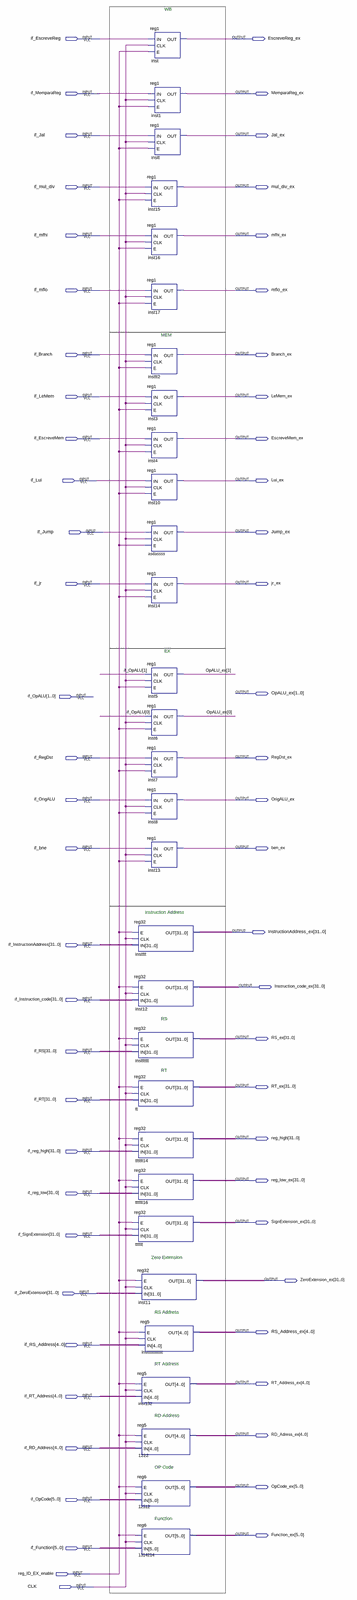
[diagram p0: schematic sheet, whole]
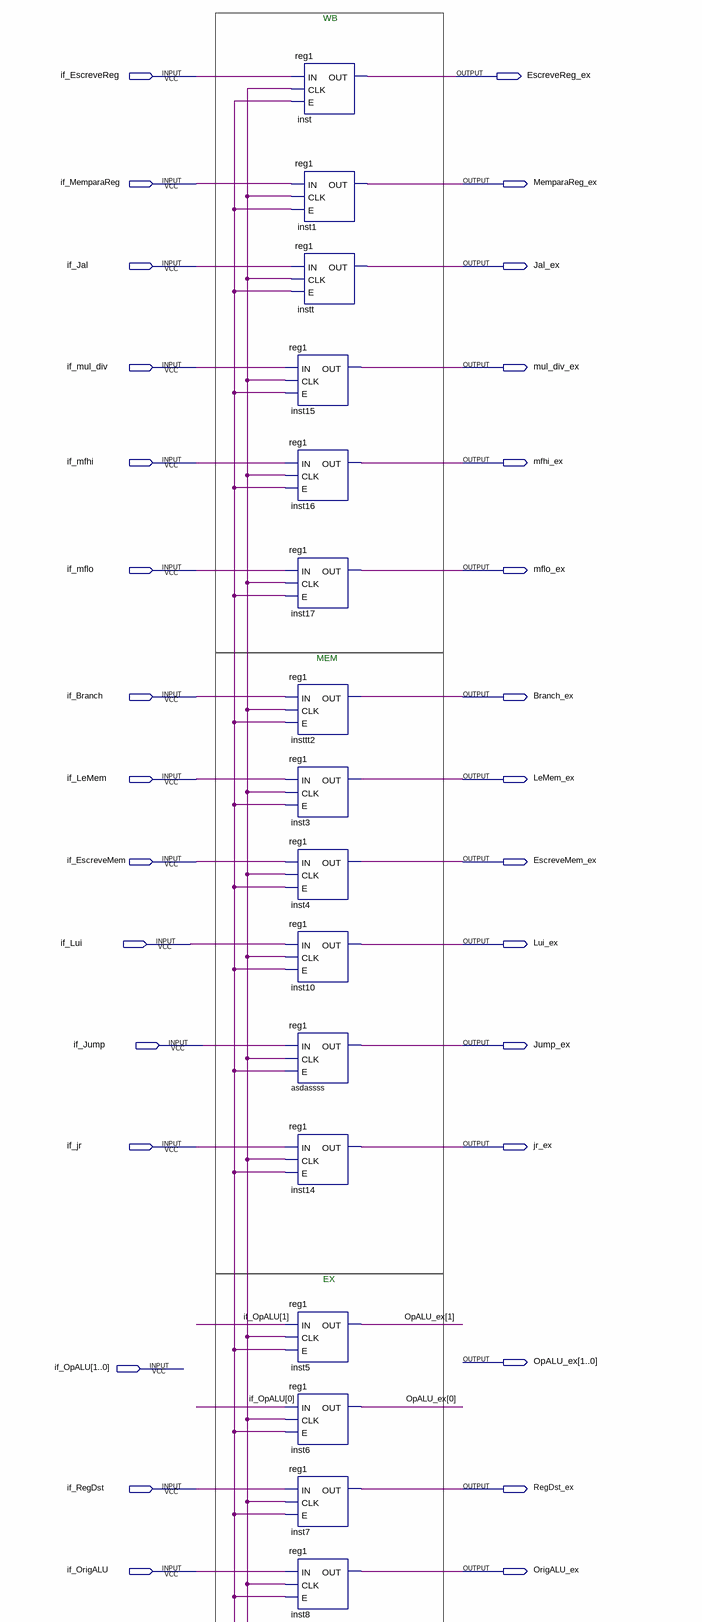
[diagram p1: schematic sheet, upper part]
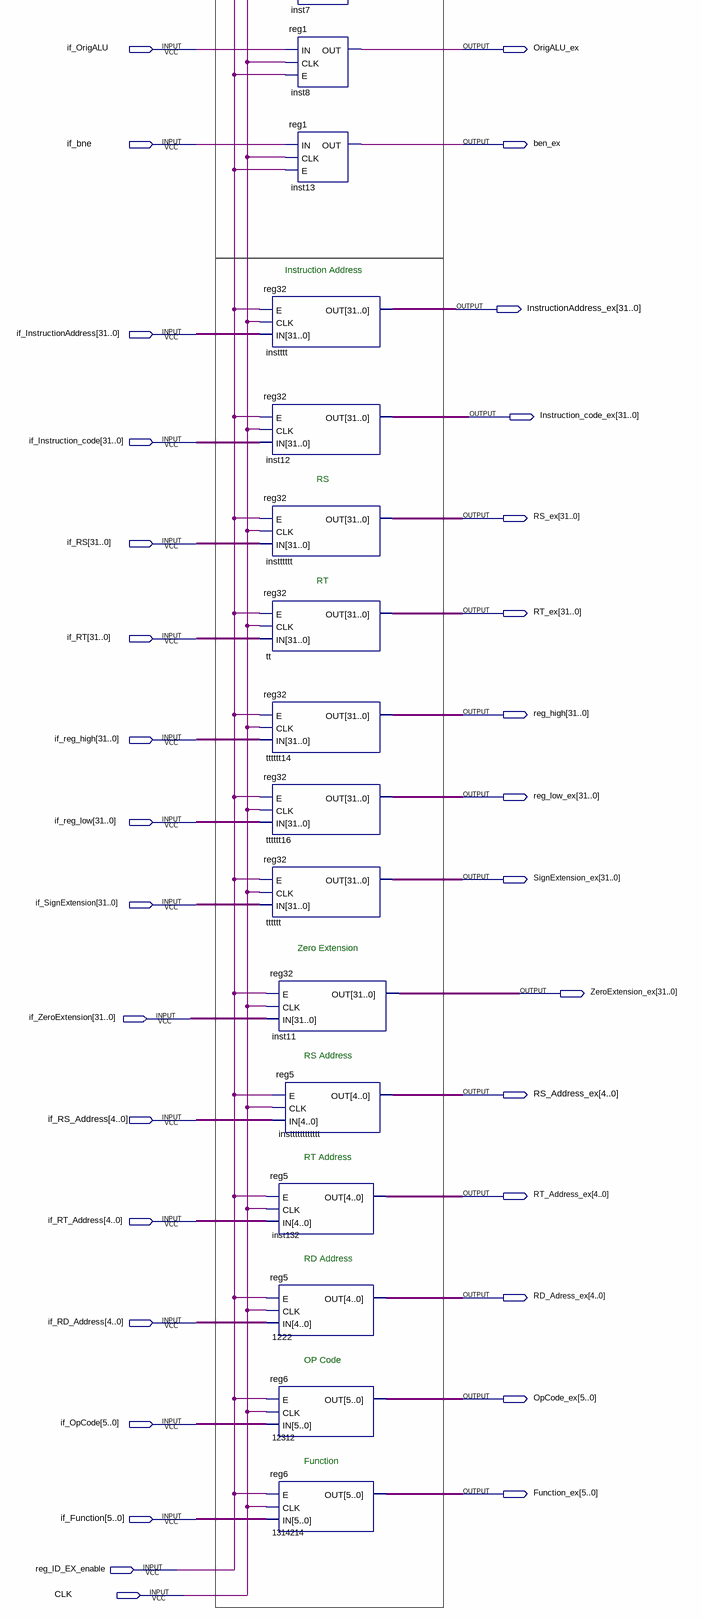
[diagram p2: schematic sheet, lower part]
// Quartus schematic reg_id_ex.bdf as structural Verilog: 30 symbols, 60 pins
module reg_id_ex (
  input  if_EscreveReg,
  input  if_MemparaReg,
  input  if_Jal,
  input  if_mul_div,
  input  if_mfhi,
  input  if_mflo,
  input  if_Branch,
  input  if_LeMem,
  input  if_EscreveMem,
  input  if_Lui,
  input  if_Jump,
  input  if_jr,
  input  [1:0] if_OpALU,
  input  if_RegDst,
  input  if_OrigALU,
  input  if_bne,
  input  [31:0] if_InstructionAddress,
  input  [31:0] if_Instruction_code,
  input  [31:0] if_RS,
  input  [31:0] if_RT,
  input  [31:0] if_reg_high,
  input  [31:0] if_reg_low,
  input  [31:0] if_SignExtension,
  input  [31:0] if_ZeroExtension,
  input  [4:0] if_RS_Address,
  input  [4:0] if_RT_Address,
  input  [4:0] if_RD_Address,
  input  [5:0] if_OpCode,
  input  [5:0] if_Function,
  input  reg_ID_EX_enable,
  input  CLK,
  output EscreveReg_ex,
  output MemparaReg_ex,
  output Jal_ex,
  output mul_div_ex,
  output mfhi_ex,
  output mflo_ex,
  output Branch_ex,
  output LeMem_ex,
  output EscreveMem_ex,
  output Lui_ex,
  output Jump_ex,
  output jr_ex,
  output [1:0] OpALU_ex,
  output RegDst_ex,
  output OrigALU_ex,
  output ben_ex,
  output [31:0] InstructionAddress_ex,
  output [31:0] Instruction_code_ex,
  output [31:0] RS_ex,
  output [31:0] RT_ex,
  output [31:0] reg_high,
  output [31:0] reg_low_ex,
  output [31:0] SignExtension_ex,
  output [31:0] ZeroExtension_ex,
  output [4:0] RS_Address_ex,
  output [4:0] RT_Address_ex,
  output [4:0] RD_Adress_ex,
  output [5:0] OpCode_ex,
  output [5:0] Function_ex
);

  reg1 inst (.IN(if_EscreveReg), .CLK(CLK), .E(reg_ID_EX_enable), .OUT(EscreveReg_ex));
  reg1 inst1 (.IN(if_MemparaReg), .CLK(CLK), .E(reg_ID_EX_enable), .OUT(MemparaReg_ex));
  reg1 instt (.IN(if_Jal), .CLK(CLK), .E(reg_ID_EX_enable), .OUT(Jal_ex));
  reg1 inst15 (.IN(if_mul_div), .CLK(CLK), .E(reg_ID_EX_enable), .OUT(mul_div_ex));
  reg1 inst16 (.IN(if_mfhi), .CLK(CLK), .E(reg_ID_EX_enable), .OUT(mfhi_ex));
  reg1 inst17 (.IN(if_mflo), .CLK(CLK), .E(reg_ID_EX_enable), .OUT(mflo_ex));
  reg1 insttt2 (.IN(if_Branch), .CLK(CLK), .E(reg_ID_EX_enable), .OUT(Branch_ex));
  reg1 inst3 (.IN(if_LeMem), .CLK(CLK), .E(reg_ID_EX_enable), .OUT(LeMem_ex));
  reg1 inst4 (.IN(if_EscreveMem), .CLK(CLK), .E(reg_ID_EX_enable), .OUT(EscreveMem_ex));
  reg1 inst10 (.IN(if_Lui), .CLK(CLK), .E(reg_ID_EX_enable), .OUT(Lui_ex));
  reg1 asdassss (.IN(if_Jump), .CLK(CLK), .E(reg_ID_EX_enable), .OUT(Jump_ex));
  reg1 inst14 (.IN(if_jr), .CLK(CLK), .E(reg_ID_EX_enable), .OUT(jr_ex));
  reg1 inst5 (.IN(if_OpALU[1]), .CLK(CLK), .E(reg_ID_EX_enable), .OUT(OpALU_ex[1]));
  reg1 inst6 (.IN(if_OpALU[0]), .CLK(CLK), .E(reg_ID_EX_enable), .OUT(OpALU_ex[0]));
  reg1 inst7 (.IN(if_RegDst), .CLK(CLK), .E(reg_ID_EX_enable), .OUT(RegDst_ex));
  reg1 inst8 (.IN(if_OrigALU), .CLK(CLK), .E(reg_ID_EX_enable), .OUT(OrigALU_ex));
  reg1 inst13 (.IN(if_bne), .CLK(CLK), .E(reg_ID_EX_enable), .OUT(ben_ex));
  reg32 instttt (.E(reg_ID_EX_enable), .CLK(CLK), .IN(if_InstructionAddress), .OUT(InstructionAddress_ex));
  reg32 inst12 (.E(reg_ID_EX_enable), .CLK(CLK), .IN(if_Instruction_code), .OUT(Instruction_code_ex));
  reg32 instttttt (.E(reg_ID_EX_enable), .CLK(CLK), .IN(if_RS), .OUT(RS_ex));
  reg32 tt (.E(reg_ID_EX_enable), .CLK(CLK), .IN(if_RT), .OUT(RT_ex));
  reg32 tttttt14 (.E(reg_ID_EX_enable), .CLK(CLK), .IN(if_reg_high), .OUT(reg_high));
  reg32 tttttt16 (.E(reg_ID_EX_enable), .CLK(CLK), .IN(if_reg_low), .OUT(reg_low_ex));
  reg32 tttttt (.E(reg_ID_EX_enable), .CLK(CLK), .IN(if_SignExtension), .OUT(SignExtension_ex));
  reg32 inst11 (.E(reg_ID_EX_enable), .CLK(CLK), .IN(if_ZeroExtension), .OUT(ZeroExtension_ex));
  reg5 instttttttttttt (.E(reg_ID_EX_enable), .CLK(CLK), .IN(if_RS_Address), .OUT(RS_Address_ex));
  reg5 inst132 (.E(reg_ID_EX_enable), .CLK(CLK), .IN(if_RT_Address), .OUT(RT_Address_ex));
  reg5 u_1222 (.E(reg_ID_EX_enable), .CLK(CLK), .IN(if_RD_Address), .OUT(RD_Adress_ex));
  reg6 u_12312 (.E(reg_ID_EX_enable), .CLK(CLK), .IN(if_OpCode), .OUT(OpCode_ex));
  reg6 u_1314214 (.E(reg_ID_EX_enable), .CLK(CLK), .IN(if_Function), .OUT(Function_ex));

  // Notes on the sheet:
  //   WB
  //   MEM
  //   EX
  //   Instruction Address
  //   RS
  //   RT
  //   Zero Extension
  //   RS Address
  //   RT Address
  //   RD Address
  //   OP Code
  //   Function
endmodule
